# EAGLE schematic ESP12_Adapter (EAGLE 9.5.1)
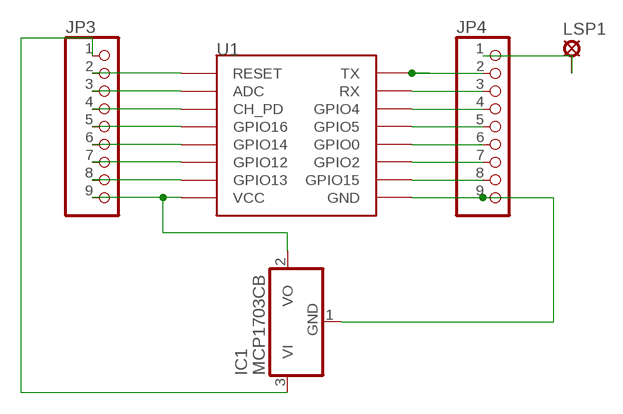
[diagram p0: schematic, sheet 1]

## Parts
IC1  MCP1703CB  [SOT23]
JP3  PINHD-1X9  [1X09]
JP4  PINHD-1X9  [1X09]
LSP1  LSP10  [LSP10]
U1  ESP12  [ESP12]

## Nets
N$1: IC1.2(VO) JP3.9 U1.VCC
N$2: JP3.8 U1.GPIO13
N$3: JP3.7 U1.GPIO12
N$4: JP3.6 U1.GPIO14
N$5: JP3.5 U1.GPIO16
N$6: JP3.4 U1.CH_PD
N$7: JP3.3 U1.ADC
N$8: JP4.1 LSP1.MP
N$9: JP3.2 U1.RESET
N$10: IC1.3(VI) JP3.1
N$11: JP4.8 U1.GPIO15
N$12: JP4.7 U1.GPIO2
N$13: JP4.6 U1.GPIO0
N$14: JP4.5 U1.GPIO5
N$15: JP4.4 U1.GPIO4
N$17: JP4.3 U1.RX
N$18: JP4.2 U1.TX
N$19: IC1.1(GND) JP4.9 U1.GND

## Library data of the parts
IC1 = linear:MCP1703: 250 mA, 16V, Low Quiescent Current LDO Regulator Source: http://ww1.microchip.com/downloads/en/DeviceDoc/22049b.pdf
JP3 JP4 = pinhead:PINHD-1X9: PIN HEADER
LSP1 = solpad:LSP10: SOLDER PAD drill 1.0 mm, distributor Buerklin, 12H555
U1 = esp8266modules:ESP12: ESP8266 Wifi module 12